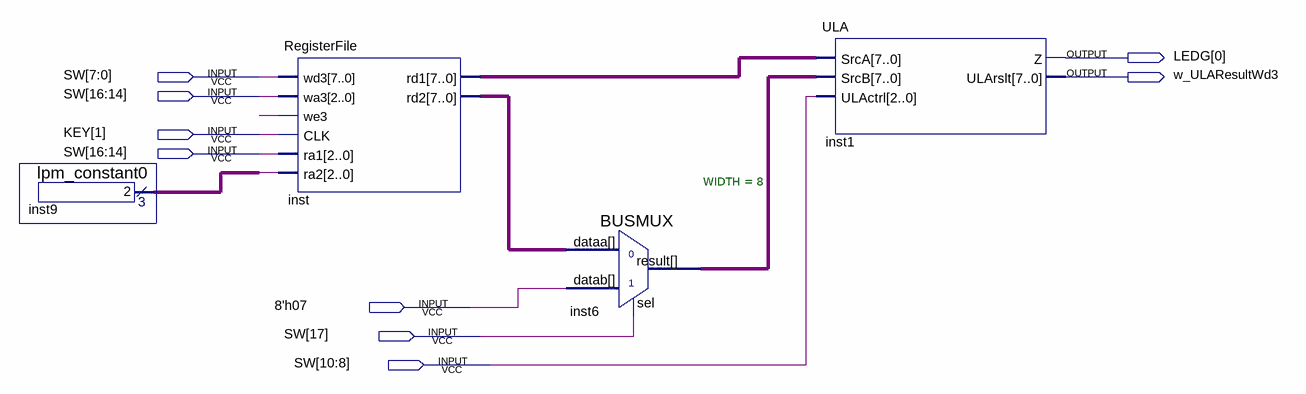
[diagram p0: schematic sheet]
// Quartus schematic Mod_Teste_Diagram.bdf as structural Verilog: 4 symbols, 9 pins
module Mod_Teste_Diagram (
  input  [17:0] SW,
  input  [1:1] KEY,
  input  \8'h07 ,
  output [0:0] LEDG,
  output w_ULAResultWd3
);

  wire undriven, undriven_2;
  wire [2:0] inst9_result;
  wire [7:0] inst6_result, inst_rd1, inst_rd2;

  lpm_constant0 inst9 (.result(inst9_result));
  RegisterFile inst (
    .wd3(SW[7:0]), .wa3(SW[16:14]), .we3(undriven), .CLK(KEY[1]), .ra1(SW[16:14]), .ra2({3{undriven_2}}),
    .rd1(inst_rd1), .rd2(inst_rd2));
  BUSMUX #(.WIDTH(8)) inst6 (.datab({8{\8'h07 }}), .sel(SW[17]), .dataa(inst_rd2), .result(inst6_result));
  ULA inst1 (.SrcA(inst_rd1), .SrcB(inst6_result), .ULActrl(SW[10:8]), .Z(LEDG[0]), .ULArslt(w_ULAResultWd3));
endmodule
